# Altium schematic sheet digital-main.SchDoc
size A; SheetNumber: 2; SheetTotal: 2
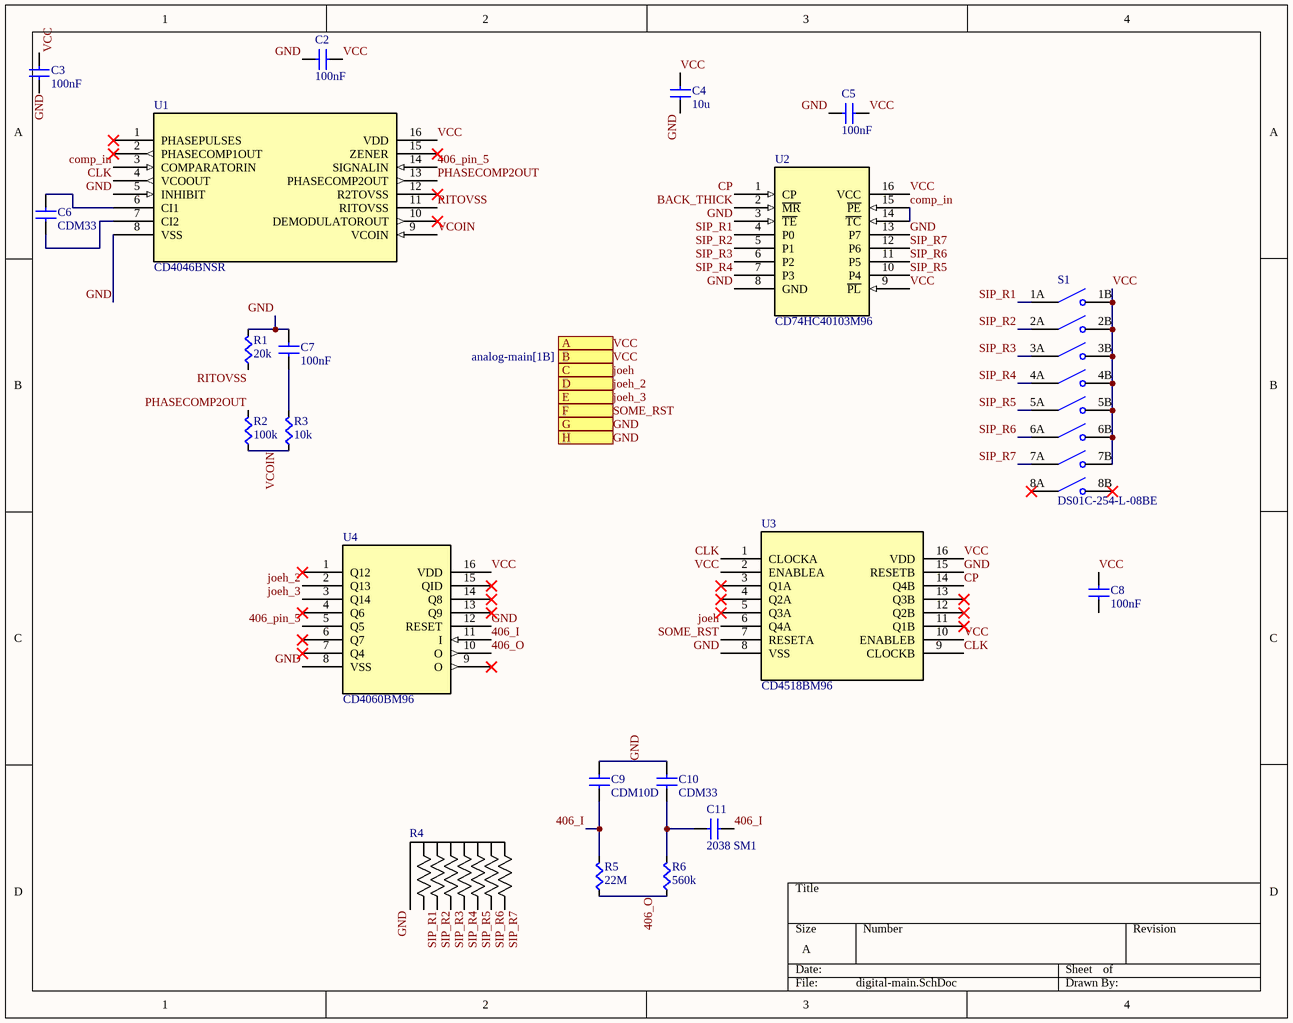
[diagram p0: digital-main.SchDoc]

## Parts
C2  value 100nF  [CAPC0603]  (hidden comment: Cap)
C3  value 100nF  [CAPC0603]  (hidden comment: Cap)
C4  value 10u  [CAPC0603]  (hidden comment: Cap)
C5  value 100nF  [CAPC0603]  (hidden comment: Cap)
C6  value CDM33  [CAPC0603]  (hidden comment: Cap)
C7  value 100nF  [CAPC0603]  (hidden comment: Cap)
C8  value 100nF  [CAPC0603]  (hidden comment: Cap)
C9  value CDM10D  [CAPC0603]  (hidden comment: Cap)
C10  value CDM33  [CAPC0603]  (hidden comment: Cap)
C11  value 2038 SM1  [CAPC0603]  (hidden comment: Cap)
R1  value 20k  [RES0603]  (hidden comment: Res)
R2  value 100k  [RES0603]  (hidden comment: Res)
R3  value 10k  [RES0603]  (hidden comment: Res)
R4  4608X-101-105LF  [BO_4608X]  (value not drawn)
R5  value 22M  [RES0603]  (hidden comment: Res)
R6  value 560k  [RES0603]  (hidden comment: Res)
S1  DS01C-254-L-08BE  [SW_DS01C-254-L-08BE]
U1  CD4046BNSR  [SOIC16-5.3MM]
U2  CD74HC40103M96  [SOIC16-3.9MM]
U3  CD4518BM96  [SOIC16-3.9MM]
U4  CD4060BM96  [SOIC16-3.9MM]

## Ports
A, B (see analog-main[1B]), C, D, E, F, G, H

## Nets
406_I: C9.2(B) C11.2(B) R5.1(A) U4.11(I)
406_O: R5.2(B) R6.2(B) U4.10(O)
406_pin_5: U1.14(SIGNALIN) U4.5(Q5)
BACK_THICK: U2.2(~{MR})
CLK: U1.4(VCOOUT) U3.1(CLOCKA) U3.9(CLOCKB)
comp_in: U1.3(COMPARATORIN) U2.14(~{TC}) U2.15(~{PE})
CP: U2.1(CP) U3.14(Q4B)
GND: C2.1(A) C3.1(A) C4.2(B) C5.1(A) C7.1(A) C9.1(A) C10.1(A) R1.1(A) R4.1 U1.5(INHIBIT) U1.8(VSS) U2.3(~{TE}) U2.8(GND) U2.13(P7) U3.8(VSS) U3.15(RESETB) U4.8(VSS) U4.12(RESET) ; port G, port H
joeh: U3.6(Q4A) ; port C
joeh_2: U4.2(Q13) ; port D
joeh_3: U4.3(Q14) ; port E
PHASECOMP2OUT: R2.1(A) U1.13(PHASECOMP2OUT)
RITOVSS: R1.2(B) U1.11(RITOVSS)
SIP_R1: R4.2 S1.1A(COM1) U2.4(P0)
SIP_R2: R4.3 S1.2A(COM2) U2.5(P1)
SIP_R3: R4.4 S1.3A(COM3) U2.6(P2)
SIP_R4: R4.5 S1.4A(COM4) U2.7(P3)
SIP_R5: R4.6 S1.5A(COM5) U2.10(P4)
SIP_R6: R4.7 S1.6A(COM6) U2.11(P5)
SIP_R7: R4.8 S1.7A(COM7) U2.12(P6)
SOME_RST: U3.7(RESETA) ; port F
VCC: C2.2(B) C3.2(B) C4.1(A) C5.2(B) C8.1(A) S1.1B(NO1) S1.2B(NO2) S1.3B(NO3) S1.4B(NO4) S1.5B(NO5) S1.6B(NO6) S1.7B(NO7) U1.16(VDD) U2.9(~{PL}) U2.16(VCC) U3.2(ENABLEA) U3.10(ENABLEB) U3.16(VDD) U4.16(VDD) ; port A, port B
VCOIN: R2.2(B) R3.2(B) U1.9(VCOIN)
NetC6_1: C6.1(A) U1.6(CI1)
NetC6_2: C6.2(B) U1.7(CI2)
NetC7_2: C7.2(B) R3.1(A)
NetC10_2: C10.2(B) C11.1(A) R6.1(A)

Not connected (* = marked no-connect by the designer): C8 2(B); S1 8A(COM8)* 8B(NO8)*; U1 1(PHASEPULSES)* 2(PHASECOMP1OUT)* 10(DEMODULATOROUT)* 12(R2TOVSS)* 15(ZENER)*; U3 3(Q1A)* 4(Q2A)* 5(Q3A)* 11(Q1B)* 12(Q2B)* 13(Q3B)*; U4 1(Q12)* 4(Q6)* 6(Q7)* 7(Q4)* 9(O)* 13(Q9)* 14(Q8)* 15(QID)*

## Library data of the parts
R1-R3 R5 R6 = Res: SMD, RES0603; Supplier 1: Digi-Key; Supplier Part Number 1: RMCF0603JT10K0CT-ND
R4 = 4608X-101-105LF: 1M Ohm ±2% 200mW Power Per Element Bussed 7 Resistor Network/Array ±100ppm/°C 8-SIP; Manufacturer_Name: Bourns Electronics; Copyright: Copyright (C) 2026 Ultra Librarian. All rights reserved.; Manufacturer_Part_Number: 4608X-101-105LF
S1 = DS01C-254-L-08BE: 8 Position, Through Hole, 2.54 mm Pitch, Raised Slide Actuator, Convex Bottom, Long Pin, DIP Switch; MF: Same Sky; SnapEDA_Link: https://www.snapeda.com/parts/DS01C-254-L-08BE/Same+Sky/view-part/?ref=snap; Package: None; Value: *; MP: DS01C-254-L-08BE; Check_prices: https://www.snapeda.com/parts/DS01C-254-L-08BE/Same+Sky/view-part/?ref=eda
U1 = CD4046BNSR: CMOS Micropower Phase-Locked Loop 16-SOP -55 to 125; Manufacturer_Name: Texas Instruments; Copyright: Copyright (C) 2025 Ultra Librarian. All rights reserved.; Manufacturer_Part_Number: CD4046BNSR; RefDes: RefDes; Type: Type
U2 = CD74HC40103M96: High Speed CMOS Logic 8-Stage Synchronous Down Counters 16-SOIC -55 to 125; Manufacturer_Name: Texas Instruments; Copyright: Copyright (C) 2025 Ultra Librarian. All rights reserved.; Manufacturer_Part_Number: CD74HC40103M96; RefDes: RefDes; Type: Type
U3 = CD4518BM96: CMOS Dual BCD Up-Counter 16-SOIC -55 to 125; Manufacturer_Name: Texas Instruments; Copyright: Copyright (C) 2026 Ultra Librarian. All rights reserved.; Manufacturer_Part_Number: CD4518BM96; RefDes: RefDes; Type: Type
U4 = CD4060BM96: CMOS 14-Stage Ripple-Carry Binary Counter/Divider and Oscillator 16-SOIC -55 to 125; Manufacturer_Name: Texas Instruments; Copyright: Copyright (C) 2025 Ultra Librarian. All rights reserved.; Manufacturer_Part_Number: CD4060BM96; RefDes: RefDes; Type: Type
C2-C11 = Cap: Supplier 1: Digi-Key; Supplier Part Number 1: 1276-1000-1-ND